# EAGLE design Ver3 (EAGLE 9.6.2)
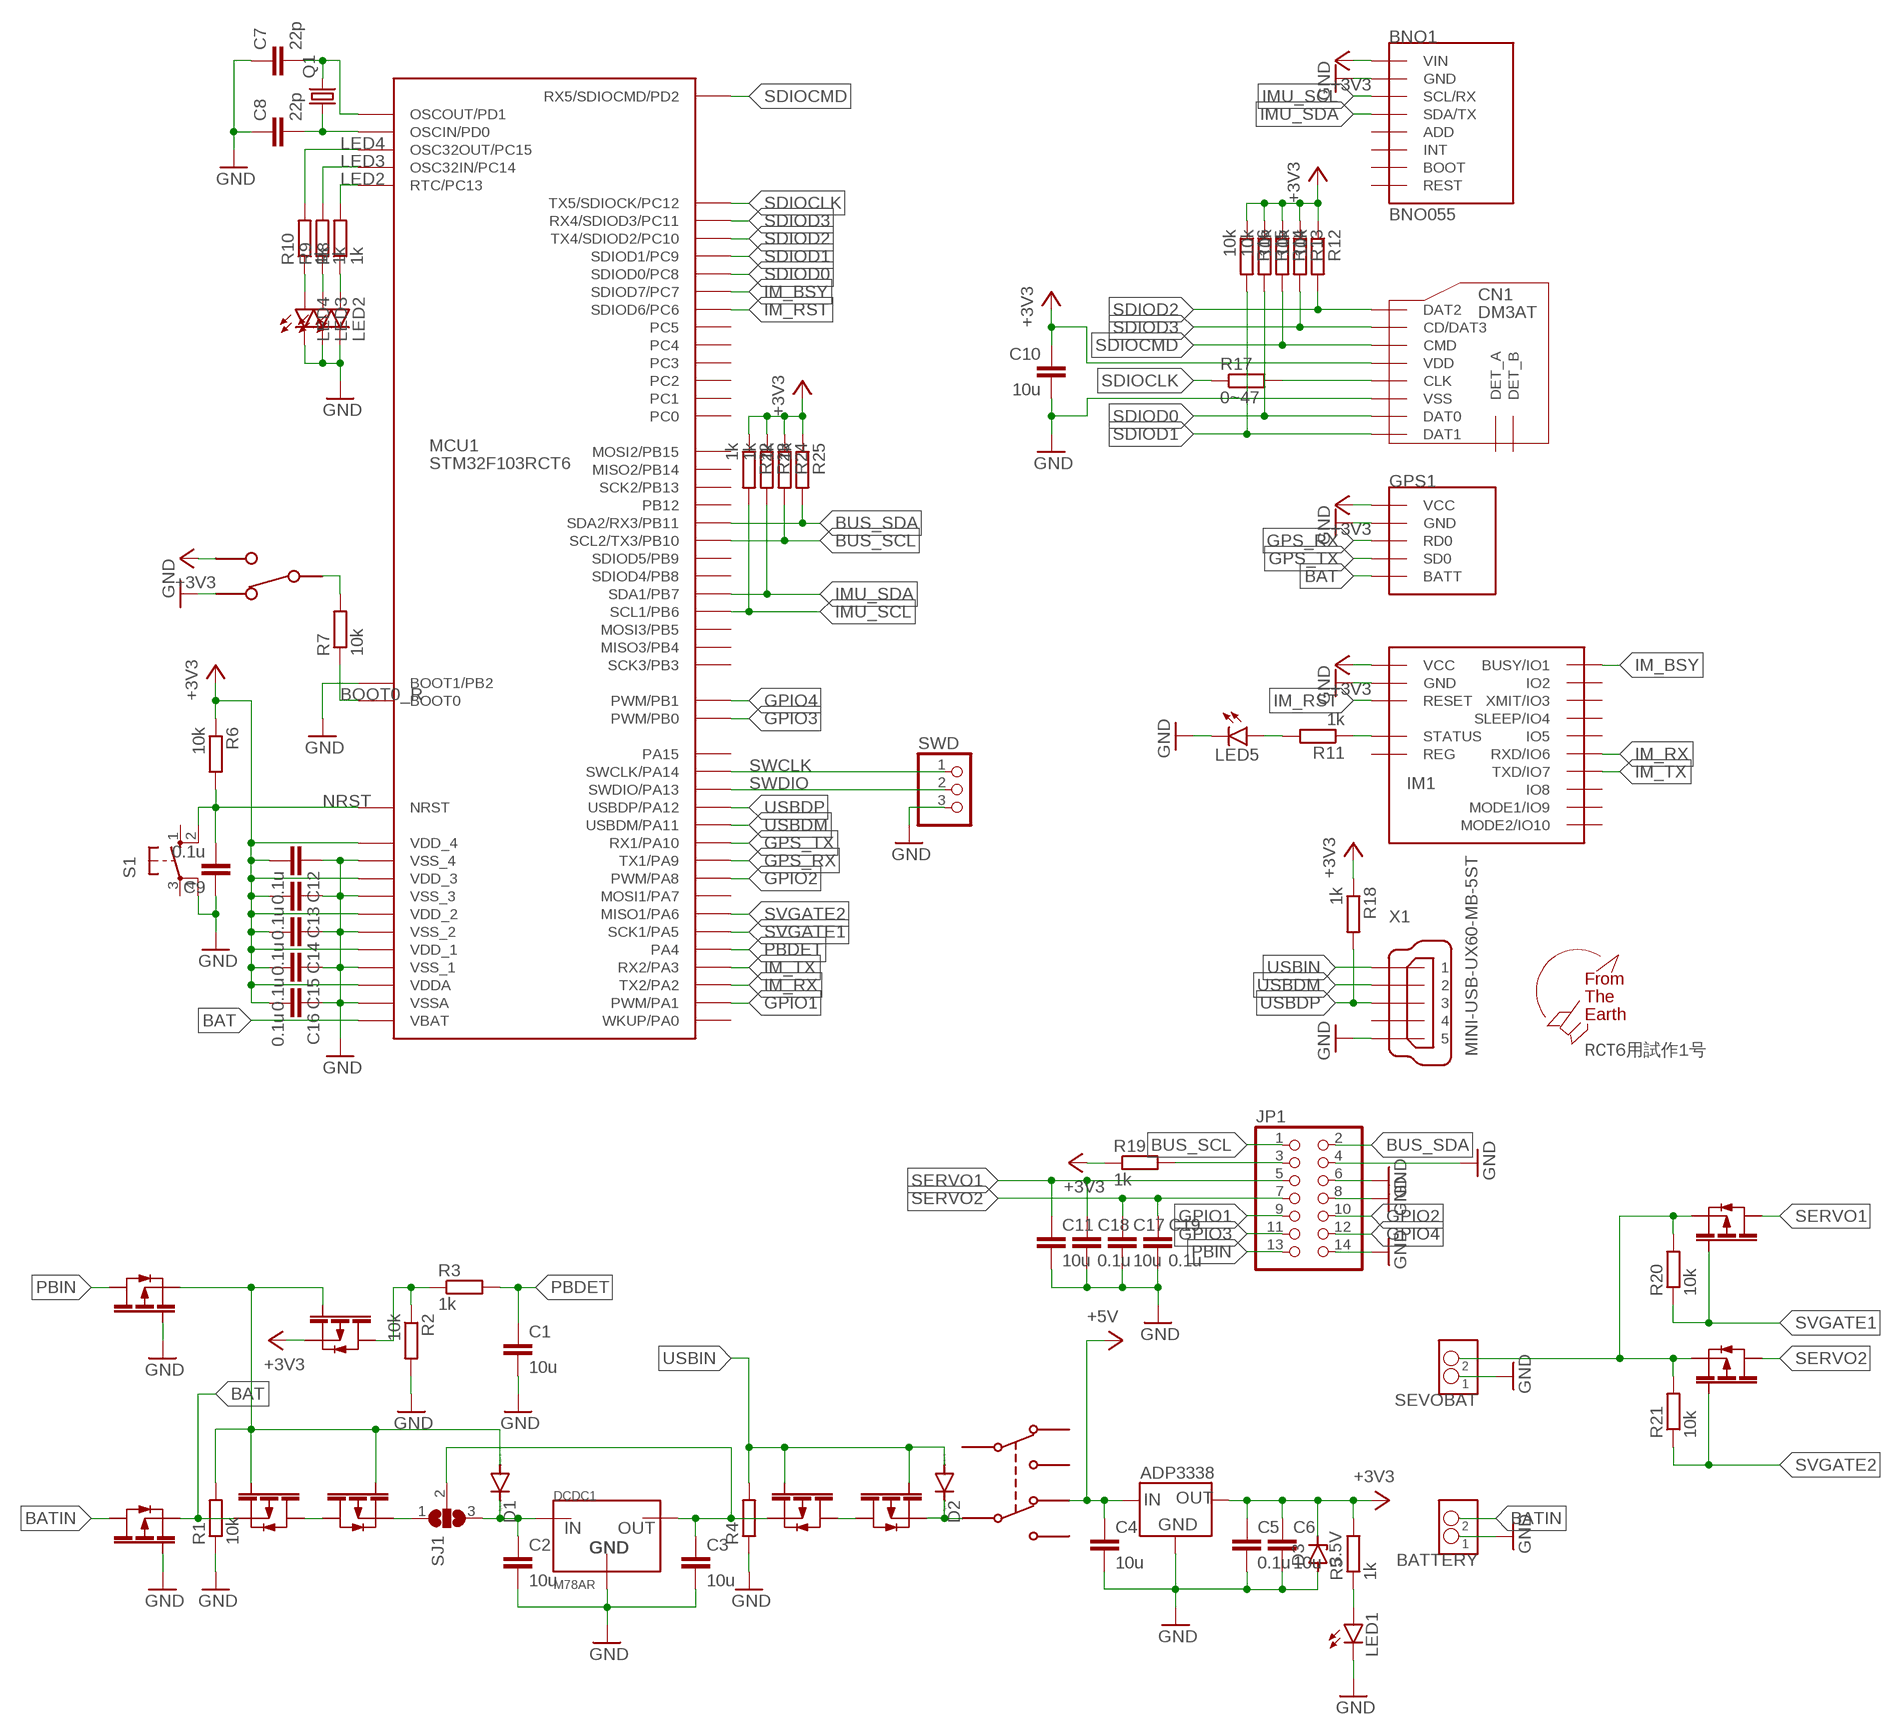
[diagram p0: schematic, sheet 1]

## Parts
BATTERY  S2B-XH-A  [S2B-XH-A]
BNO1  BNO055  [BNO055]
C1  10u  C-EUC0805  [C0805]
C2  10u  C-EUC0805  [C0805]
C3  10u  C-EUC0805  [C0805]
C4  10u  C-EUC0805  [C0805]
C5  0.1u  C-EUC0805  [C0805]
C6  10u  C-EUC0805  [C0805]
C7  22p  C-EUC0805  [C0805]
C8  22p  C-EUC0805  [C0805]
C9  0.1u  C-EUC0805  [C0805]
C10  10u  C-EUC0805  [C0805]
C11  10u  C-EUC0805  [C0805]
C12  0.1u  C-EUC0805  [C0805]
C13  0.1u  C-EUC0805  [C0805]
C14  0.1u  C-EUC0805  [C0805]
C15  0.1u  C-EUC0805  [C0805]
C16  0.1u  C-EUC0805  [C0805]
C17  10u  C-EUC0805  [C0805]
C18  0.1u  C-EUC0805  [C0805]
C19  0.1u  C-EUC0805  [C0805]
CN1  DM3AT  [DM3AT]
D1  DIODE-SOD123  [SOD123]
D2  DIODE-SOD123  [SOD123]
D3  3.5V  ZENER-DIODESMB  [SMB]
DCDC1  M78AR  [M78AR]
FET1  PCH  [SOT-23]
FET2  PCH  [SOT-23]
FET3  PCH  [SOT-23]
FET4  PCH  [SOT-23]
FET5  PCH  [SOT-23]
FET6  PCH  [SOT-23]
FET7  PCH  [SOT-23]
FET8  PCH  [SOT-23]
FET9  PCH  [SOT-23]
GPS1  GPS-54D  [GPS-54D]
IC1  ADP3338-3.3  [SOT-223]
IM1  IM920C  [IM920C]
JP1  PINHD-2X7  [2X07]
LED1  LEDSML0603  [SML0603]
LED2  LEDSML0603  [SML0603]
LED3  LEDSML0603  [SML0603]
LED4  LEDSML0603  [SML0603]
LED5  LEDSML0603  [SML0603]
MCU1  STM32F103RCT6  [LQFP64]
Q1  CRYSTALHC49S  [HC49/S]
R1  10k  R-EU_R0603  [R0603]
R2  10k  R-EU_R0603  [R0603]
R3  1k  R-EU_R0603  [R0603]
R4  R-EU_R0603  [R0603]
R5  1k  R-EU_R0603  [R0603]
R6  10k  R-EU_R0603  [R0603]
R7  10k  R-EU_R0603  [R0603]
R8  1k  R-EU_R0603  [R0603]
R9  1k  R-EU_R0603  [R0603]
R10  1k  R-EU_R0603  [R0603]
R11  1k  R-EU_R0603  [R0603]
R12  10k  R-EU_R0603  [R0603]
R13  10k  R-EU_R0603  [R0603]
R14  10k  R-EU_R0603  [R0603]
R15  10k  R-EU_R0603  [R0603]
R16  10k  R-EU_R0603  [R0603]
R17  0~47  R-EU_R0603  [R0603]
R18  1k  R-EU_R0603  [R0603]
R19  1k  R-EU_R0603  [R0603]
R20  10k  R-EU_R0603  [R0603]
R21  10k  R-EU_R0603  [R0603]
R22  1k  R-EU_R0603  [R0603]
R23  1k  R-EU_R0603  [R0603]
R24  1k  R-EU_R0603  [R0603]
R25  1k  R-EU_R0603  [R0603]
RCT6用試作1号  F.T.E.LOGO  [LOGO]
S1  10-XX  [B3F-10XX]
SEVOBAT  S2B-XH-A  [S2B-XH-A]
SJ1  SJ2W  [SJ_2]
SWD  PINHD-1X3/90  [1X03/90]
U$2  SSSS213202  [SMD_6P]
U$3  MSS22D18  [MSS22D18]
X1  MINI-USB-UX60-MB-5ST  [UX60-MB-5ST]

## Nets
3V3_R [POWER_L]: JP1.3 R19.2
+3V3 [POWER_L]: BNO1.P1(VIN) C5.1 C6.1 C10.1 C12.2 C13.2 C14.2 C15.2 C16.2 CN1.VDD D3.C FET5.P$2 GPS1.VCC IC1.1(OUT) IC1.2(OUT) IM1.$P17(VCC) MCU1.P$13(VDDA) MCU1.P$19(VDD_4) MCU1.P$32(VDD_1) MCU1.P$48(VDD_2) MCU1.P$64(VDD_3) R5.2 R6.1 R12.1 R13.1 R14.1 R15.1 R16.1 R18.1 R19.1 R22.1 R23.1 R24.1 R25.1 U$2.P$0(PD1) U$2.P$5(PD1)
+5V [POWER_L]: C4.1 IC1.3(IN) U$3.P$2
BAT [POWER_L]: FET1.P$2 FET3.P$2 GPS1.BATT MCU1.P$1(VBAT)
BAT_FET2FET [POWER_L]: FET2.P$3 FET3.P$3
BAT_FET2JMP [POWER_L]: FET2.P$2 SJ1.1
BATIN [POWER_L]: BATTERY.P$2 FET1.P$3
BOOT0_PH [SIGNAL]: R7.2 U$2.P$1(PD2) U$2.P$4(PD2)
BOOT0_R [SIGNAL]: MCU1.P$60(BOOT0) R7.1
BUS_SCL [SIGNAL]: JP1.1 MCU1.P$29(SCL2/TX3/PB10) R24.2
BUS_SDA [SIGNAL]: JP1.2 MCU1.P$30(SDA2/RX3/PB11) R25.2
DCDCIN [POWER_L]: C2.1 D1.C DCDC1.P3(IN) SJ1.3
GND [GND]: BATTERY.P$1 BNO1.P2(GND) C1.2 C2.2 C3.2 C4.2 C5.2 C6.2 C7.1 C8.1 C9.1 C10.2 C11.2 C12.1 C13.1 C14.1 C15.1 C16.1 C17.2 C18.2 C19.2 CN1.VSS D3.A DCDC1.P2(GND) FET1.P$1 FET4.P$1 GPS1.GND IC1.4(GND) IM1.$P18(GND) JP1.4 JP1.6 JP1.8 JP1.14 LED1.C LED2.C LED3.C LED4.C LED5.C MCU1.P$12(VSSA) MCU1.P$18(VSS_4) MCU1.P$28(BOOT1/PB2) MCU1.P$31(VSS_1) MCU1.P$47(VSS_2) MCU1.P$63(VSS_3) R1.1 R2.2 R4.1 S1.4(P1) SEVOBAT.P$1 SWD.3 U$2.P$2(PD3) U$2.P$3(PD3) X1.5
GPIO1 [SIGNAL]: JP1.9 MCU1.P$15(PWM/PA1)
GPIO2 [SIGNAL]: JP1.10 MCU1.P$41(PWM/PA8)
GPIO3 [SIGNAL]: JP1.11 MCU1.P$26(PWM/PB0)
GPIO4 [SIGNAL]: JP1.12 MCU1.P$27(PWM/PB1)
GPS_RX [SIGNAL]: GPS1.RD0 MCU1.P$42(TX1/PA9)
GPS_TX [SIGNAL]: GPS1.SD0 MCU1.P$43(RX1/PA10)
IM_BSY [SIGNAL]: IM1.$P1(BUSY/IO1) MCU1.P$38(SDIOD7/PC7)
IM_LED [SIGNAL]: LED5.A R11.2
IM_R [SIGNAL]: IM1.$P15(STATUS) R11.1
IM_RST [SIGNAL]: IM1.$P19(RESET) MCU1.P$37(SDIOD6/PC6)
IM_RX [SIGNAL]: IM1.$P6(RXD/IO6) MCU1.P$16(TX2/PA2)
IM_TX [SIGNAL]: IM1.$P7(TXD/IO7) MCU1.P$17(RX2/PA3)
IMU_SCL [SIGNAL]: BNO1.P3(SCL/RX) MCU1.P$58(SCL1/PB6) R22.2
IMU_SDA [SIGNAL]: BNO1.P4(SDA/TX) MCU1.P$59(SDA1/PB7) R23.2
LED2 [SIGNAL]: MCU1.P$2(RTC/PC13) R8.2
LED2R [SIGNAL]: LED2.A R8.1
LED3 [SIGNAL]: MCU1.P$3(OSC32IN/PC14) R9.2
LED3R [SIGNAL]: LED3.A R9.1
LED4 [SIGNAL]: MCU1.P$4(OSC32OUT/PC15) R10.2
LED4R [SIGNAL]: LED4.A R10.1
NRST [SIGNAL]: C9.2 MCU1.P$7(NRST) R6.2 S1.2(S1)
OSCIN [SIGNAL]: C8.2 MCU1.P$5(OSCIN/PD0) Q1.1
OSCOUT [SIGNAL]: C7.2 MCU1.P$6(OSCOUT/PD1) Q1.2
PB_ARV2GATES [POWER_L]: D1.A FET2.P$1 FET3.P$1 FET4.P$2 FET5.P$1 R1.2
PB_FET2R [SIGNAL]: FET5.P$3 R2.1 R3.1
PBDET [SIGNAL]: C1.1 MCU1.P$20(PA4) R3.2
PBIN [POWER_L]: FET4.P$3 JP1.13
PWR_SWC [POWER_L]: D2.C FET7.P$2 U$3.P$1
REG_DCDC2FET [POWER_L]: C3.1 DCDC1.P1(OUT) FET6.P$2 SJ1.2
REG_FET2FET [POWER_L]: FET6.P$3 FET7.P$3
REG_R2LED [SIGNAL]: LED1.A R5.1
SDIOCLK [SIGNAL]: MCU1.P$53(TX5/SDIOCK/PC12) R17.1
SDIOCLK_R [SIGNAL]: CN1.CLK R17.2
SDIOCMD [SIGNAL]: CN1.CMD MCU1.P$54(RX5/SDIOCMD/PD2) R14.2
SDIOD0 [SIGNAL]: CN1.DAT0 MCU1.P$39(SDIOD0/PC8) R15.2
SDIOD1 [SIGNAL]: CN1.DAT1 MCU1.P$40(SDIOD1/PC9) R16.2
SDIOD2 [SIGNAL]: CN1.DAT2 MCU1.P$51(TX4/SDIOD2/PC10) R12.2
SDIOD3 [SIGNAL]: CN1.CD/DAT3 MCU1.P$52(RX4/SDIOD3/PC11) R13.2
SERVO1 [POWER_H]: C11.1 C18.1 FET8.P$3 JP1.5
SERVO2 [POWER_H]: C17.1 C19.1 FET9.P$3 JP1.7
SVGATE1 [SIGNAL]: FET8.P$1 MCU1.P$21(SCK1/PA5) R20.1
SVGATE2 [SIGNAL]: FET9.P$1 MCU1.P$22(MISO1/PA6) R21.1
SVIN [POWER_H]: FET8.P$2 FET9.P$2 R20.2 R21.2 SEVOBAT.P$2
SWCLK [SIGNAL]: MCU1.P$49(SWCLK/PA14) SWD.1
SWDIO [SIGNAL]: MCU1.P$46(SWDIO/PA13) SWD.2
USBDM [SIGNAL]: MCU1.P$44(USBDM/PA11) X1.2
USBDP [SIGNAL]: MCU1.P$45(USBDP/PA12) R18.2 X1.3
USBIN [POWER_L]: D2.A FET6.P$1 FET7.P$1 R4.2 X1.1
Unconnected: BNO1.P5(ADD) BNO1.P6(INT) BNO1.P7(BOOT) BNO1.P8(REST) CN1.DET_A CN1.DET_B IM1.$P2(IO2) IM1.$P3(XMIT/IO3) IM1.$P4(SLEEP/IO4) IM1.$P5(IO5) IM1.$P8(IO8) IM1.$P9(MODE1/IO9) IM1.$P10(MODE2/IO10) IM1.$P16(REG) MCU1.P$8(PC0) MCU1.P$9(PC1) MCU1.P$10(PC2) MCU1.P$11(PC3) MCU1.P$14(WKUP/PA0) MCU1.P$23(MOSI1/PA7) MCU1.P$24(PC4) MCU1.P$25(PC5) MCU1.P$33(PB12) MCU1.P$34(SCK2/PB13) MCU1.P$35(MISO2/PB14) MCU1.P$36(MOSI2/PB15) MCU1.P$50(PA15) MCU1.P$55(SCK3/PB3) MCU1.P$56(MISO3/PB4) MCU1.P$57(MOSI3/PB5) MCU1.P$61(SDIOD4/PB8) MCU1.P$62(SDIOD5/PB9) S1.1(S) S1.3(P) U$3.P$0 U$3.P$3 U$3.P$4 U$3.P$5 X1.4

## Library data of the parts
BATTERY SEVOBAT = JST-Con:S2B-XH-A
BNO1 = BNO055:BNO055
C1-C19 = rcl:C-EU: CAPACITOR, European symbol; SPICEPREFIX: C
CN1 = microSD:DM3AT
D1 D2 = diode:DIODE-: DIODE
D3 = diode:ZENER-DIODE: Z-Diode
DCDC1 = M78AR:M78AR
FET1-FET9 = MOSFET:PCH
GPS1 = GPS-54D:GPS-54D
IC1 = ADP3338:ADP3338-3.3
IM1 = IM920:IM920C
JP1 = pinhead:PINHD-2X7: PIN HEADER
LED1-LED5 = led:LED: LED OSRAM: - CHIPLED LG R971, LG N971, LY N971, LG Q971, LY Q971, LO R971, LY R971 LH N974, LH R974 LS Q976, LO Q976, LY Q976 LO Q996 - Hyper CHIPLED LW Q18S LB Q993, LB Q99A, LB R99A - SideLED LS A670, LO A670, LY A670, LG A670, LP A670 LB A673, LV A673, LT A673, LW A673 LH A674 LY A675 LS A676, LA A676, LO A676, LY A676, LW A676 LS A679, LY A679, LG A679 - Hyper Micro SIDELED® LS Y876, LA Y876, LO Y876, LY Y876 LT Y87S - SmartLED LW L88C, LW L88S LB L89C, LB L89S, LG L890 LS L89K, LO L89K, LY L89K LS L896, LA L896, LO L896, LY L896 - TOPLED LS T670, LO T670, LY T670, LG T670, LP T670 LSG T670, LSP T670, LSY T670, LOP T670, LYG T670 LG T671, LOG T671, LSG T671 LB T673, LV T673, LT T673, LW T673 LH T674 LS T676, LA T676, LO T676, LY T676, LB T676, LH T676, LSB T676, LW T676 LB T67C, LV T67C, LT T67C, LS T67K, LO T67K, LY T67K, LW E67C LS E67B, LA E67B, LO E67B, LY E67B, LB E67C, LV E67C, LT E67C LW T67C LS T679, LY T679, LG T679 LS T770, LO T770, LY T770, LG T770, LP T770 LB T773, LV T773, LT T773, LW T773 LH T774 LS E675, LA E675, LY E675, LS T675 LS T776, LA T776, LO T776, LY T776, LB T776 LHGB T686 LT T68C, LB T68C - Hyper Mini TOPLED® LB M676 - Mini TOPLED Santana® LG M470 LS M47K, LO M47K, LY M47K Source: http://www.osram.convergy.de LUXEON: - LUMILED® LXK2-PW12-R00, LXK2-PW12-S00, LXK2-PW14-U00, LXK2-PW14-V00 LXK2-PM12-R00, LXK2-PM12-S00, LXK2-PM14-U00 LXK2-PE12-Q00, LXK2-PE12-R00, LXK2-PE12-S00, LXK2-PE14-T00, LXK2-PE14-U00 LXK2-PB12-K00, LXK2-PB12-L00, LXK2-PB12-M00, LXK2-PB14-N00, LXK2-PB14-P00, LXK2-PB14-Q00 LXK2-PR12-L00, LXK2-PR12-M00, LXK2-PR14-Q00, LXK2-PR14-R00 LXK2-PD12-Q00, LXK2-PD12-R00, LXK2-PD12-S00 LXK2-PH12-R00, LXK2-PH12-S00 LXK2-PL12-P00, LXK2-PL12-Q00, LXK2-PL12-R00 Source: www.luxeon.com KINGBRIGHT: KA-3528ASYC Source: www.kingbright.com
MCU1 = STM32F103:STM32F103RCT6
Q1 = crystal:CRYSTAL: CRYSTAL; OC_FARNELL: 1667008; OC_NEWARK: unknown
R1-R25 = rcl:R-EU_: RESISTOR, European symbol; SPICEPREFIX: R
RCT6用試作1号 = logo:F.T.E.LOGO
S1 = switch-omron:10-XX: OMRON SWITCH; MPN: B3F-1000; OC_FARNELL: 176432; OC_NEWARK: 36M3542
SJ1 = jumper:SJ2W: SMD solder JUMPER
SWD = pinhead:PINHD-1X3: PIN HEADER
U$2 = switch_slide:SSSS213202
U$3 = switch_slide:MSS22D18
X1 = con-hirose:MINI-USB-: MINI USB Connector Source: http://www.hirose.co.jp/cataloge_hp/e24000019.pdf; OC_FARNELL: unknown; OC_NEWARK: unknown

## Net classes
1 SIGNAL: width 0.152 mm, drill 0.305 mm, clearance 0.152 mm
2 POWER_H: width 0.457 mm, drill 0.305 mm, clearance 0.152 mm
3 POWER_L: width 0.305 mm, drill 0.305 mm, clearance 0.152 mm
4 GND: width 0.305 mm, drill 0.305 mm, clearance 0.152 mm

## Board
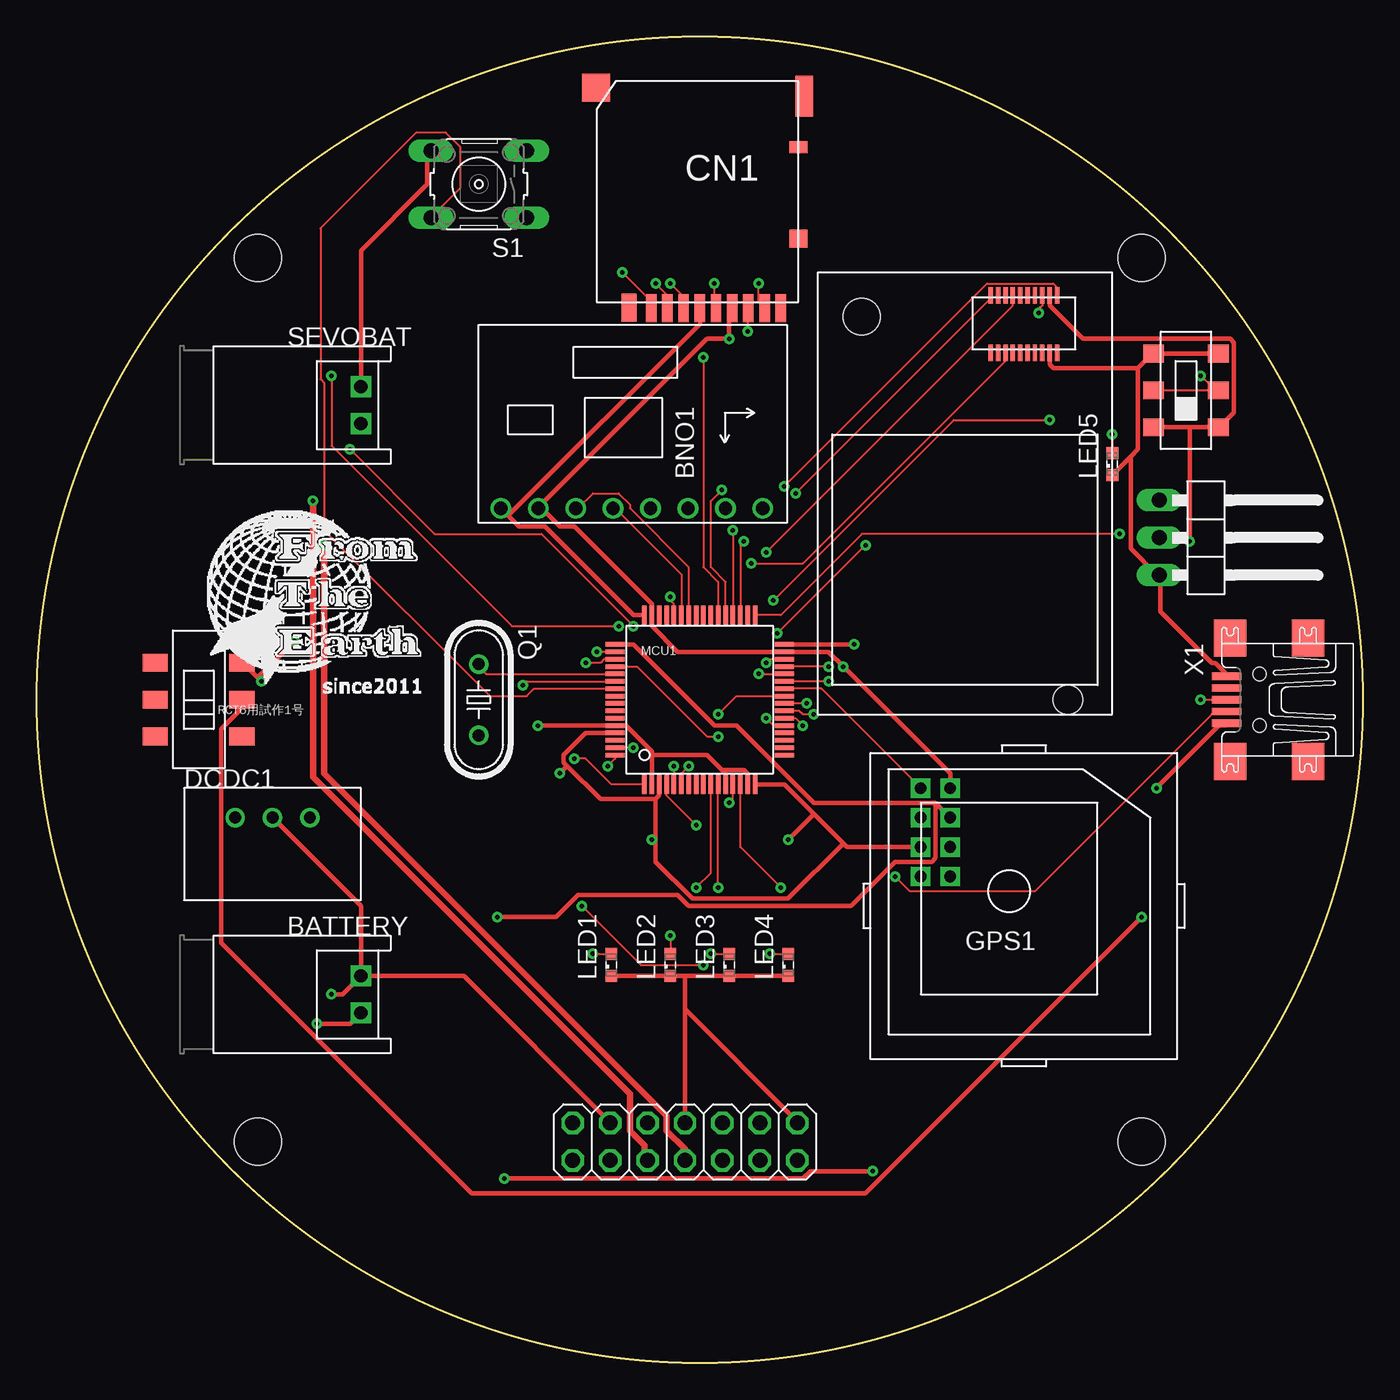
[diagram p1: board, top side]
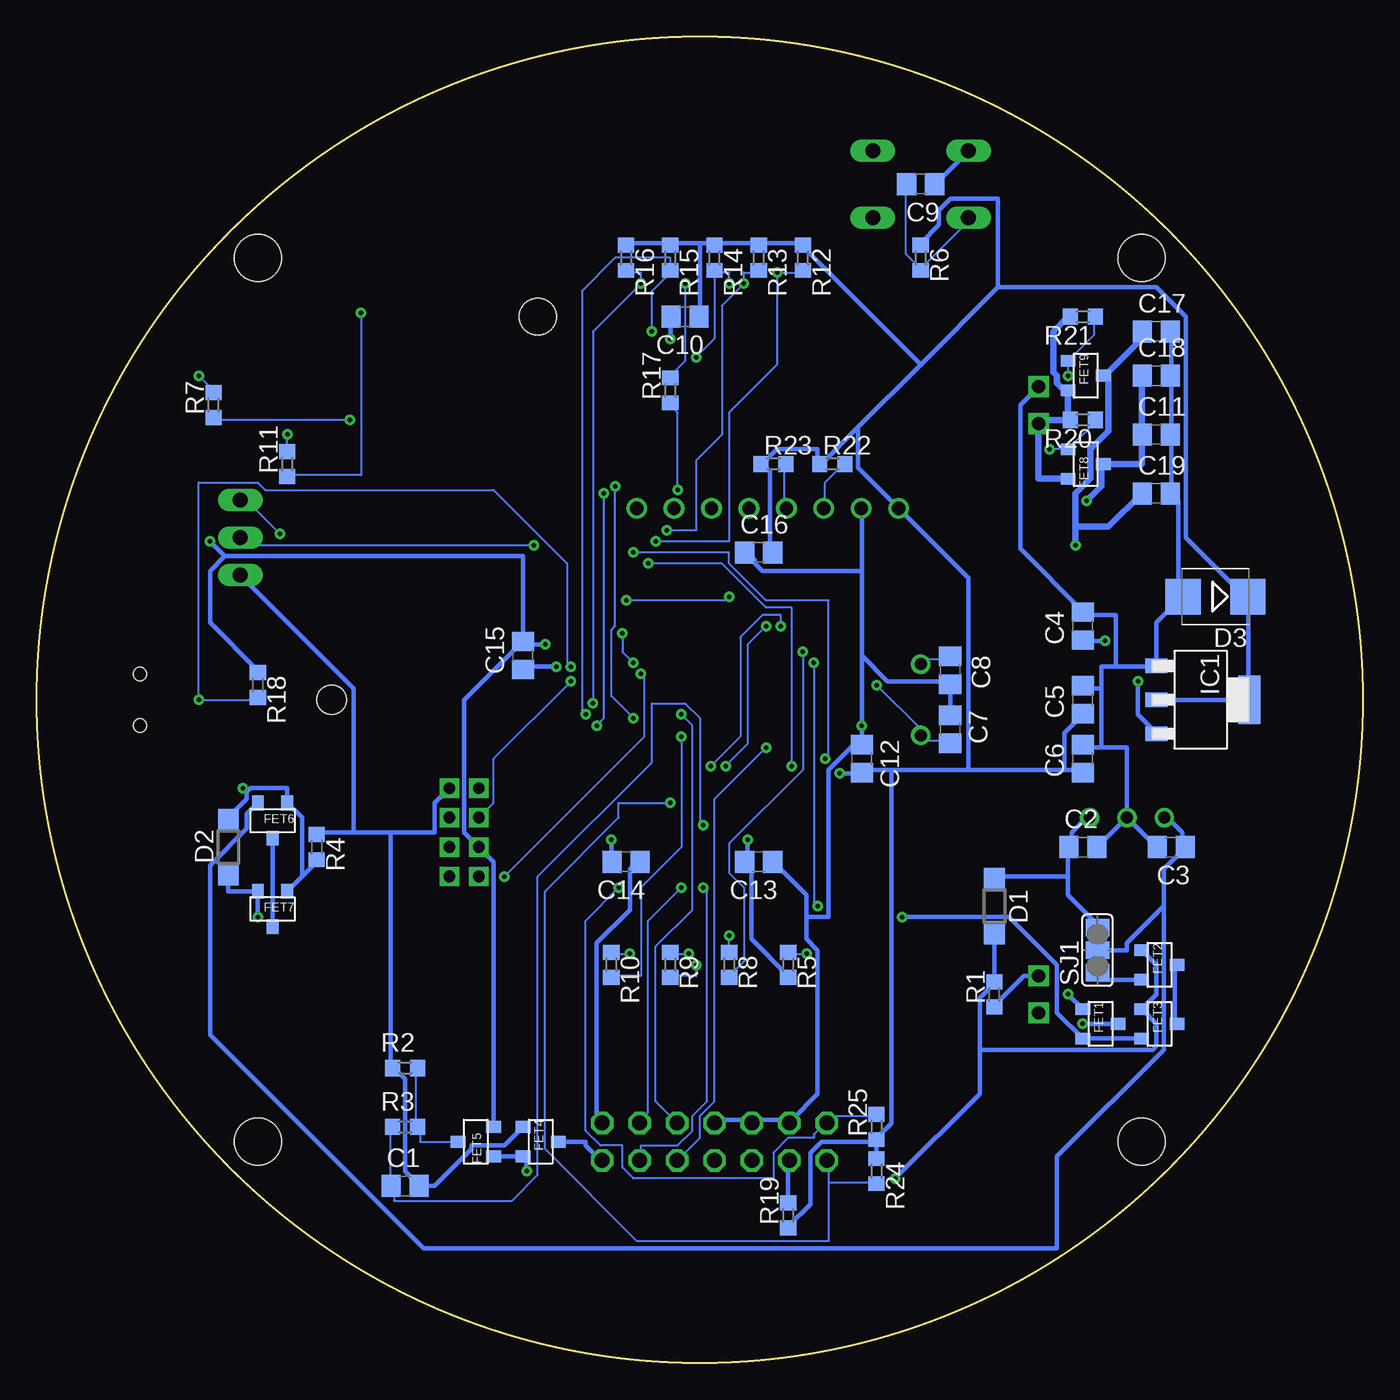
[diagram p2: board, bottom side, seen from below]

Size 90 x 90 mm. Coordinates in mm from the lower left corner, seen from the top.
Outline: circle at 45,45 radius 45
Copper layers (1*16): Top 0.035mm / dielectric 1.5mm / Bottom 0.035mm
Design rules "PCBGoGo": minimum track width 6mil, minimum drill 0.2mm, track to track 6mil, track to pad 6mil, pad to pad 6mil, via to via 6mil, smd to smd 6mil, copper to edge 0.2mm, drill to drill 6mil, minimum pad ring 10mil, minimum via ring 8mil, stop-mask expansion 4mil, vias tented up to drill 0mil, thermal gap 10mil
Holes 3.2 mm at 75,75 15,75 15,15 75,15

### Footprints (pad centres in the part's own frame; a part is rotated, then mirrored left to right if it is on the bottom)
S2B-XH-A = drill 0.9 square: P$1 0,1.25; P$2 0,-1.25
BNO055 = drill 0.9: P1 -7,11.5; P2 -7,8.96; P3 -7,6.42; P4 -7,3.88; P5 -7,1.34; P6 -7,-1.2; P7 -7,-3.74; P8 -7,-6.28
C0805 = smd 1.3 x 1.5: 1 -0.95,0; 2 0.95,0
DM3AT = smd 0.7 x 1.9: CD/DAT3 2.2,6.4; CLK -1.1,6.4; CMD 1.1,6.4; DAT0 -3.3,6.4; DAT1 -4.4,6.4; DAT2 3.3,6.4; DET_B -5.5,6.4; VDD 0,6.4; VSS -2.2,6.4 | smd 1.2 x 0.8: DET_A -6.7,-4.5 | smd 1 x 1.9: P$9 4.8,6.381 | smd 1.2 x 1.2: P$11 -6.7,1.7 | smd 1.2 x 2.8: P$13 -7.081,-7.973 | smd 1.9 x 1.9: P$14 7.054,-8.562
SOD123 = smd 1.4 x 1.4: A 1.9,0; C -1.9,0
SMB = smd 2.4 x 2.4: A 2.2,0; C -2.2,0
M78AR = drill 0.8: P1 -2.54,0; P2 0,0; P3 2.54,0
SOT-23 = smd 0.8 x 1: P$1 -1,0; P$2 1,0; P$3 0,2.4
GPS-54D = drill 0.8 square: BATT -5,6; GND -5,8; NC1 -5,4; NC2 -7,2; NC3 -5,2; RD0 -7,8; SD0 -7,6; VCC -7,4
SOT-223 = smd 3.3 x 1.5: 1 0,3.3 | smd 1 x 1.5: 2 0,-3; 3 2.3,-3; 4 -2.3,-3
IM920C = smd 0.3 x 1.1: $P1 -1.75,-13.45; $P2 -1.75,-9.55; $P3 -2.25,-13.45; $P4 -2.25,-9.55; $P5 -2.75,-13.45; $P6 -2.75,-9.55; $P7 -3.25,-13.45; $P8 -3.25,-9.55; $P9 -3.75,-13.45; $P10 -3.75,-9.55; $P11 -4.25,-13.45; $P12 -4.25,-9.55; $P13 -4.75,-13.45; $P14 -4.75,-9.55; $P15 -5.25,-13.45; $P16 -5.25,-9.55; $P17 -5.75,-13.45; $P18 -5.75,-9.55; $P19 -6.25,-13.45; $P20 -6.25,-9.55 | hole 2.5: 7,-12 | hole 2: -7,14
2X07 = drill 1.016 octagon: 1 -7.62,-1.27; 2 -7.62,1.27; 3 -5.08,-1.27; 4 -5.08,1.27; 5 -2.54,-1.27; 6 -2.54,1.27; 7 0,-1.27; 8 0,1.27; 9 2.54,-1.27; 10 2.54,1.27; 11 5.08,-1.27; 12 5.08,1.27; 13 7.62,-1.27; 14 7.62,1.27
SML0603 = smd 0.8 x 0.8: A 0.75,0; C -0.75,0
LQFP64 = smd 1.27 x 0.305: P$1 -5.75,3.75; P$2 -5.75,3.25; P$3 -5.75,2.75; P$4 -5.75,2.25; P$5 -5.75,1.75; P$6 -5.75,1.25; P$7 -5.75,0.75; P$8 -5.75,0.25; P$9 -5.75,-0.25; P$10 -5.75,-0.75; P$11 -5.75,-1.25; P$12 -5.75,-1.75; P$13 -5.75,-2.25; P$14 -5.75,-2.75; P$15 -5.75,-3.25; P$16 -5.75,-3.75; P$33 5.75,-3.75; P$34 5.75,-3.25; P$35 5.75,-2.75; P$36 5.75,-2.25; P$37 5.75,-1.75; P$38 5.75,-1.25; P$39 5.75,-0.75; P$40 5.75,-0.25; P$41 5.75,0.25; P$42 5.75,0.75; P$43 5.75,1.25; P$44 5.75,1.75; P$45 5.75,2.25; P$46 5.75,2.75; P$47 5.75,3.25; P$48 5.75,3.75 | smd 0.305 x 1.27: P$17 -3.75,-5.75; P$18 -3.25,-5.75; P$19 -2.75,-5.75; P$20 -2.25,-5.75; P$21 -1.75,-5.75; P$22 -1.25,-5.75; P$23 -0.75,-5.75; P$24 -0.25,-5.75; P$25 0.25,-5.75; P$26 0.75,-5.75; P$27 1.25,-5.75; P$28 1.75,-5.75; P$29 2.25,-5.75; P$30 2.75,-5.75; P$31 3.25,-5.75; P$32 3.75,-5.75; P$49 3.75,5.75; P$50 3.25,5.75; P$51 2.75,5.75; P$52 2.25,5.75; P$53 1.75,5.75; P$54 1.25,5.75; P$55 0.75,5.75; P$56 0.25,5.75; P$57 -0.25,5.75; P$58 -0.75,5.75; P$59 -1.25,5.75; P$60 -1.75,5.75; P$61 -2.25,5.75; P$62 -2.75,5.75; P$63 -3.25,5.75; P$64 -3.75,5.75
HC49/S = drill 0.813: 1 -2.413,0; 2 2.413,0
R0603 = smd 1 x 1.1: 1 -0.85,0; 2 0.85,0
B3F-10XX = drill 1.016 long: 1 -3.251,2.261; 2 3.251,2.261; 3 -3.251,-2.261; 4 3.251,-2.261
SJ_2 = smd 1.168 x 1.6: 1 -1.524,0; 2 0,0; 3 1.524,0
1X03/90 = drill 1.016 long: 1 -2.54,-3.81; 2 0,-3.81; 3 2.54,-3.81
SMD_6P = smd 1.2 x 1.4: P$0 -2.5,-2.2; P$1 0,-2.2; P$2 2.5,-2.2; P$3 2.5,2.2; P$4 0,2.2; P$5 -2.5,2.2
MSS22D18 = smd 1.2 x 1.7: P$0 -2.492,-2.923; P$1 0.008,-2.923; P$2 2.508,-2.923; P$3 2.508,2.977; P$4 0.008,2.977; P$5 -2.492,2.977
UX60-MB-5ST = smd 2 x 0.5: 1 2.25,1.6; 2 2.25,0.8; 3 2.25,0; 4 2.25,-0.8; 5 2.25,-1.6 | smd 2.2 x 2.5: M1 -3.3,-4.2; M2 -3.3,4.2; M3 2,4.2; M4 2,-4.2 | hole 0.9: 0,-1.75; 0,1.75

### Placement (x,y rotation side)
BATTERY  22,25 0 top
BNO1  43,65 90 top
C1  65,12 0 bottom
C2  19,35 0 bottom
C3  13,35 180 bottom
C4  19,50 90 bottom
C5  19,45 90 bottom
C6  19,41 90 bottom
C7  28,43 270 bottom
C8  28,47 90 bottom
C9  30,80 180 bottom
C10  46,71 180 bottom
C11  14,63 0 bottom
C12  34,41 270 bottom
C13  41,34 180 bottom
C14  50,34 180 bottom
C15  57,48 90 bottom
C16  41,55 0 bottom
C17  14,70 0 bottom
C18  14,67 0 bottom
C19  14,59 0 bottom
CN1  45,78 180 top
D1  25,31 270 bottom
D2  77,35 90 bottom
D3  10,52 180 bottom
DCDC1  16,37 0 top
FET1  19,23 270 bottom
FET2  15,27 270 bottom
FET3  15,23 270 bottom
FET4  57,15 270 bottom
FET5  59,15 90 bottom
FET6  74,38 180 bottom
FET7  74,32 180 bottom
FET8  20,61 270 bottom
FET9  20,67 270 bottom
GPS1  67,31 0 top
IC1  11,45 270 bottom
IM1  63,59 180 top
JP1  44,15 0 top
LED1  39,27 90 top
LED2  43,27 90 top
LED3  47,27 90 top
LED4  51,27 90 top
LED5  73,61 90 top
MCU1  45,45 0 top
Q1  30,45 270 top
R1  25,25 90 bottom
R2  65,20 180 bottom
R3  65,16 180 bottom
R4  71,35 270 bottom
R5  39,27 270 bottom
R6  30,75 270 bottom
R7  78,65 90 bottom
R8  43,27 270 bottom
R9  47,27 270 bottom
R10  51,27 270 bottom
R11  73,61 90 bottom
R12  38,75 270 bottom
R13  41,75 270 bottom
R14  44,75 270 bottom
R15  47,75 270 bottom
R16  50,75 270 bottom
R17  47,66 90 bottom
R18  75,46 270 bottom
R19  39,10 90 bottom
R20  19,64 180 bottom
R21  19,71 180 bottom
R22  36,61 0 bottom
R23  40,61 0 bottom
R24  33,13 270 bottom
R25  33,16 90 bottom
RCT6用試作1号  11,44 0 top
S1  30,80 180 top
SEVOBAT  22,65 0 top
SJ1  18,28 90 bottom
SWD  80,56 270 top
U$2  78,66 90 top
U$3  11,45 90 top
X1  83,45 180 top

### Tracks (layer width: path | path; a pad name or v marks a point on that pad's centre or on a via)
3V3_R
  Bottom 0.305: R19.2 39,13.5 JP1.3
+3V3  (via drill 0.3)
  Top 0.305: MCU1.P$13 37.25,42.75 35.75,41.25 35.75,40.75 36,40.5 | 36,40.5 38.25,38.25 42,38.25 | 42,38.25 42.25,38.5 MCU1.P$19 | MCU1.P$32 50.75,39.25 52.75,37.25 | 54.75,35.25 55,35 GPS1.VCC | 54.75,35.25 52.75,37.25 | 52.75,37.25 v51,35.5 | 42,35.5 42,34 44.5,31.5 51,31.5 54.75,35.25 | 42,35.5 42,38.25 | 42,35.5 v41.75,35.5 | IM1.$P17 68.75,71.75 71,69.5 81,69.5 81.25,69.25 81.25,64.5 80.25,63.5 U$2.P$0 78.25,63.5 | 78.25,63.5 U$2.P$5 | v55.5,48.75 MCU1.P$48 | v78.25,55.75 78.25,63.5 | MCU1.P$64 40.5,50.75 34.5,56.75 32.75,56.75 32,57.5 | BNO1.P1 32,57.5 | CN1.VDD 45,70.5 32,57.5 | v35.5,40 36,40.5
  Bottom 0.305: 41.75,34 41.5,33.75 41.5,28.75 39,26.25 R5.2 | FET5.P$2 59,34 GPS1.VCC 61,36 61,45 57,49 | v51,35.5 51,34 C14.2 | v41.75,35.5 41.75,34 | 41.75,34 C13.2 | 77.25,54.75 78.25,53.75 78.25,50.25 75,47 R18.1 | 77.25,54.75 57,54.75 57,49 | v55.5,48.75 57,48.75 C15.2 57,49 | 77.25,54.75 v78.25,55.75 | 33,15 R24.1 | 33,15 36.75,15 37.5,14.25 37.5,10.75 39,9.25 R19.1 | 33,15 R25.1 33,15.25 32,16.25 32,40.25 | 20.25,40.25 19,40.25 C6.1 | 20.25,40.25 20.25,42.75 19,44 C5.1 | 20.25,40.25 26.75,40.25 | 26.75,40.25 32,40.25 | 32,40.25 34,40.25 C12.2 34,40 v35.5,40 | 7.75,45 IC1.2 | 7.75,45 7.75,52 D3.C 8,52 12,56 12,71 14,73 24.75,73 | 7.75,45 IC1.1 | 41,76 38,76 R12.1 38,75.75 30,67.75 | 41,76 44,76 | 41,76 R13.1 | 44,76 45,76 | 45,76 47,76 | 44,76 R14.1 | 47,76 50,76 R16.1 | 47,76 R15.1 | 45,76 45,71 C10.1 | 40.75,61 40.25,60.5 40.25,55 C16.2 | 24.75,73 24.75,79 28,79 28.75,78.25 28.75,77.25 30,76 R6.1 | 34.25,63.5 36.75,61 R22.1 37,61 37,62 39.75,62 40.75,61 | 34.25,63.5 30,67.75 | 30,67.75 24.75,73 | 40.75,61 R23.1 | 34.25,63.5 34.25,60.75 BNO1.P1 26.75,53.25 26.75,40.25
+5V  (via drill 0.3)
  Top 0.305: 15,46.5 14,47.5 U$3.P$2 | 15,46.5 v17.5,49 | 15,46.5 v15.25,46.25
  Bottom 0.305: v15.25,46.25 15.25,44 14,42.75 IC1.3 | v17.5,49 19,49 C4.1
BAT  (via drill 0.3)
  Top 0.305: MCU1.P$1 40.5,48.75 46,43.25 47.5,43.25 52.75,38 61,38 | GPS1.BATT 61,38 | v31.25,30.25 35.25,30.25 36.75,31.75 43.5,31.75 44.25,31 55.25,31 58.25,34 60.75,34 61,34.25 61,38
  Bottom 0.305: FET3.P$2 FET1.P$2 20.75,23.75 20.75,27 24,30.25 v31.25,30.25
BAT_FET2FET
  Bottom 0.305: FET3.P$3 12.75,23 12.75,27 FET2.P$3
BAT_FET2JMP
  Bottom 0.305: FET2.P$2 18,26 SJ1.1
BATIN  (via drill 0.3)
  Top 0.305: v19,23 21.25,23 BATTERY.P$2
  Bottom 0.305: v19,23 FET1.P$3
BOOT0_PH  (via drill 0.3)
  Top 0.152: 80,66 v79,67 | 80,66 U$2.P$4 | 80,66 U$2.P$1
  Bottom 0.152: v79,67 78,66 R7.2
BOOT0_R  (via drill 0.3)
  Top 0.152: v68.75,64 62.25,64 v50,51.75 | v43,52 43,51.75 43.25,51.5 MCU1.P$60
  Bottom 0.152: v68.75,64 78,64 R7.1 | v50,51.75 43,51.75 v43,52
BUS_SCL  (via drill 0.3)
  Top 0.152: MCU1.P$29 47.25,38.25 v47,38
  Bottom 0.152: 36.25,12.25 33,12.25 R24.2 | 36.25,12.25 36.25,13.5 JP1.1 | v47,38 50.5,38 50.5,37 55.5,32 55.5,14.5 49.25,8.25 36.25,8.25 36.25,12.25
BUS_SDA  (via drill 0.3)
  Top 0.152: MCU1.P$30 47.75,35 v50.5,32.25
  Bottom 0.152: R25.2 33,16.75 36.25,16.75 36.25,16.5 JP1.2 36.5,16.25 37.25,15.5 37.25,15.25 39,15.25 40,14.25 40,12.5 49.5,12.5 50.25,13.25 50.25,14.75 51.75,14.75 52.75,15.75 52.75,30 v50.5,32.25
DCDCIN
  Bottom 0.305: 20,33 25,33 D1.C | 20,33 20,35 C2.1 19.75,35 19.75,36 18.75,37 DCDC1.P3 | 20,33 20,31.75 18,29.75 SJ1.3
GND  (via drill 0.3)
  Top 0.305: X1.5 80.75,46.75 80,47.5 79.75,47.5 76.25,51 76.25,53.25 SWD.3 76,53.5 74.25,55.25 74.25,61.5 | 74.25,61.5 74.75,62 74.75,67.5 | 74.25,61.5 LED5.C | 74.75,67.5 75.75,68.5 U$2.P$3 U$2.P$2 | IM1.$P18 68.75,67.75 69,67.5 74.75,67.5 | GPS1.GND 62,40 v54.75,47.25 53.75,48.25 MCU1.P$47 43.5,48.25 41.75,50 MCU1.P$63 41.75,51.5 36.5,56.75 35.5,56.75 34.25,58 BNO1.P2 34,58 45.5,69.5 v47,69.5 47,71.5 CN1.VSS | v20,25 20.75,25 BATTERY.P$1 | SEVOBAT.P$1 22,75.5 26.5,80 26.5,82.25 S1.4 | BATTERY.P$1 22,31 DCDC1.P2 | LED1.C LED2.C 44,26.25 | 44,26.25 LED3.C LED4.C | JP1.8 44,24 | 44,24 44,26.25 | 44,24 51.5,16.5 JP1.14 | MCU1.P$18 41.75,41.25 | 41.75,41.25 41.75,41.5 40,43.25 MCU1.P$12 v34,43.25 | MCU1.P$28 46.75,40 46.5,40.25 | 46.5,40.25 45.5,41.25 41.75,41.25 | MCU1.P$31 48.25,40 48,40.25 46.5,40.25 | BATTERY.P$1 29,26.25 38.75,16.5 JP1.4
  Bottom 0.305: FET4.P$1 58.25,14.75 60.5,14.75 60.5,14.5 63,12 C1.2 64.25,12 64.25,12.25 65,13 65,19.25 65.75,20 R2.2 66,20 66,36 | 66,36 63,36 63,38 GPS1.GND | 66,36 68.5,36 | 68.5,36 71,36 R4.1 | v54.75,47.25 57,47.25 C15.1 | 68.5,36 68.5,45.75 76,53.25 SWD.3 | 13,67 13,70 C17.2 | 13,63 13,59 | 13,63 13,67 | 13,67 C18.2 | 13,63 C11.2 | v20,25 FET1.P$1 | BATTERY.P$1 23,26.25 25,24.25 R1.1 | C9.1 29,80 S1.4 | DCDC1.P2 14,35 C3.2 | DCDC1.P2 18,35 C2.2 | 17.75,41.75 16,41.75 DCDC1.P2 | 17.75,41.75 19,41.75 C6.2 | 17.75,45.75 19,45.75 C5.2 | 17.75,41.75 17.75,45.75 | 16.75,47.25 17.75,47.25 17.75,45.75 | 16.75,47.25 14,47.25 IC1.4 14,50.25 12.5,51.75 | 16.75,47.25 16.75,50.75 19,50.75 C4.2 19,51 23.25,55.25 23.25,65 SEVOBAT.P$1 | 12.5,51.75 12.25,52 D3.A 12.5,51.75 | 13,59 12.5,58.5 12.5,51.75 | 13,59 C19.2 | C14.1 49.25,34 49.75,33.5 49.75,30.75 52,28.5 52,16.75 51.75,16.5 JP1.14 | 37.75,30.25 37.75,28.75 37,28 37,18.25 38.75,16.5 JP1.4 39,16.5 41.25,16.5 JP1.6 41.5,16.5 44,16.5 JP1.8 | 37.75,30.25 37.75,31.75 40,34 C13.1 | v47,69.5 47,71 C10.2 | C7.1 C8.1 28,46.25 32.25,46.25 34,48 | 34,53.75 34,58 BNO1.P2 | 34,53.75 34,48 | 34,48 v34,43.25 34,42.5 | 34,42.5 C12.1 | 34,53.75 40.75,53.75 41.25,54.25 41.25,54.5 41.75,55 C16.1 | 37.75,30.25 36.25,30.25 36.25,40.25 34,42.5
GPIO1  (via drill 0.3)
  Top 0.152: v40.5,41.75 MCU1.P$15
  Bottom 0.152: v40.5,41.75 44,38.25 44,17.75 45,16.75 45,15.25 46.5,13.75 JP1.9
GPIO2  (via drill 0.3)
  Top 0.152: MCU1.P$41 47.5,45.25 v46.25,44
  Bottom 0.152: v46.25,44 45.5,43.25 45.5,30.75 48,28.25 48,17.75 46.75,16.5 JP1.10
GPIO3  (via drill 0.3)
  Top 0.152: MCU1.P$26 45.75,33.25 v44.75,32.25
  Bottom 0.152: v44.75,32.25 44.5,32 44.5,17.75 45.5,16.75 45.5,15.75 46.5,14.75 49,14.75 49,13.75 JP1.11
GPIO4  (via drill 0.3)
  Top 0.152: v46.25,32.25 MCU1.P$27
  Bottom 0.152: v46.25,32.25 48.5,30 48.5,17 49,16.5 JP1.12
GPS_RX
  Top 0.152: MCU1.P$42 53.25,45.75 GPS1.RD0
GPS_TX  (via drill 0.3)
  Top 0.152: v53.75,46.25 MCU1.P$43
  Bottom 0.152: v53.75,46.25 59,41 59,38 GPS1.SD0
IM_BSY  (via drill 0.3)
  Top 0.152: v51.5,59 64.75,72.25 IM1.$P1 | v52,43.25 51.5,43.75 MCU1.P$38
  Bottom 0.152: v51.5,59 51.5,43.75 v52,43.25
IM_LED  (via drill 0.3)
  Top 0.152: v73,63 LED5.A
  Bottom 0.152: R11.2 v73,63
IM_R  (via drill 0.3)
  Top 0.152: v68,71.25 68,71.5 68.25,71.75 IM1.$P15
  Bottom 0.152: v68,71.25 68,60.25 73,60.25 R11.1
IM_RST  (via drill 0.3)
  Top 0.152: IM1.$P19 69.25,73 69,73.25 64.5,73.25 v50.75,59.5 | v49.5,43.75 50,43.25 MCU1.P$37
  Bottom 0.152: v50.75,59.5 50.75,50 51,49.75 51,45.25 v49.5,43.75
IM_RX  (via drill 0.3)
  Top 0.152: IM1.$P6 65.75,68 52,54.25 v48.5,54.25 | v38.75,40.5 39.25,41 MCU1.P$16
  Bottom 0.152: v48.5,54.25 43.5,54.25 40.5,51.25 38.75,51.25 v38.75,40.5
IM_TX  (via drill 0.3)
  Top 0.152: IM1.$P7 66.25,71.75 v49.5,55 | v36.5,41 37.25,41 39,39.25 MCU1.P$17
  Bottom 0.152: v49.5,55 43,55 43,54.25 40.5,51.75 36.25,51.75 36.25,41.25 v36.5,41
IMU_SCL
  Top 0.152: MCU1.P$58 44.25,54 40.25,58 40.25,58.25 39.5,59 37.75,59 36.75,58 BNO1.P3
  Bottom 0.152: R22.2 35.25,61 36.5,59.75 36.5,58 BNO1.P3
IMU_SDA
  Top 0.152: MCU1.P$59 43.75,53.5 39.25,58 BNO1.P4
  Bottom 0.152: R23.2 39.25,61 39.25,58 BNO1.P4
LED2  (via drill 0.3)
  Top 0.152: MCU1.P$2 v38,48.25
  Bottom 0.152: v38,48.25 38,40.25 43,35.25 43,33.25 42,32.25 42,27.25 43,26.25 R8.2
LED2R  (via drill 0.3)
  Top 0.152: v43,29 LED2.A
  Bottom 0.152: R8.1 v43,29
LED3  (via drill 0.3)
  Top 0.152: v45.25,27 41,27 v37,31 | v37.25,47.5 38.25,47.5 38.5,47.75 MCU1.P$3
  Bottom 0.152: v45.25,27 45.25,26.25 47,26.25 R9.2 | v37,31 37.25,31.25 v37.25,47.5
LED3R  (via drill 0.3)
  Top 0.152: v45.75,27.75 LED3.A
  Bottom 0.152: v45.75,27.75 LED3.A R9.1
LED4  (via drill 0.3)
  Top 0.152: v46.25,42.5 45.5,42.5 40.75,47.25 MCU1.P$4
  Bottom 0.152: v46.25,42.5 46.25,35 49,32.25 49,26.25 51,26.25 R10.2
LED4R  (via drill 0.3)
  Top 0.152: v49.75,27.75 LED4.A
  Bottom 0.152: v49.75,27.75 LED4.A R10.1
NRST
  Top 0.152: MCU1.P$7 33.75,45.75 33.25,45.25 30.75,45.25 19.5,56.5 19.5,66.5 19.25,66.75 19.25,77 25.75,83.5 27.75,83.5 28.75,82.5 28.75,79.75 S1.2
  Bottom 0.152: 30,74.25 26.75,77.5 S1.2 | 30,74.25 31,75.25 31,80 C9.2 | 30,74.25 R6.2
OSCIN
  Top 0.152: MCU1.P$5 30.5,46.75 30,47.25 Q1.1
  Bottom 0.152: Q1.1 30,47.75 28,47.75 C8.2
OSCOUT  (via drill 0.3)
  Top 0.152: MCU1.P$6 33.25,46.25 v33,46
  Bottom 0.152: v33,46 30,43 Q1.2 30,42.25 28,42.25 C7.2
PB_ARV2GATES  (via drill 0.3)
  Top 0.305: v56.75,13 52.5,13 52,12.5 v31.75,12.5
  Bottom 0.305: FET2.P$1 14,27 14,25 FET3.P$1 14,23 14,21.5 14.25,21.25 26,21.25 | FET5.P$1 FET4.P$2 56.75,13.75 v56.75,13 | D1.A R1.2 25,25.75 26,24.75 26,21.25 | v31.75,12.5 26,18.25 26,21.25
PB_FET2R
  Bottom 0.152: FET5.P$3 64,15 64,16 R3.1 64.25,16 64.25,20 R2.1
PBDET  (via drill 0.3)
  Top 0.152: MCU1.P$20 42.75,38.5 v44.75,36.5
  Bottom 0.152: R3.2 66,16 66,12 C1.1 65.75,12 65.75,11 57.75,11 56,12.75 56,33 48.25,40.75 48.25,44.75 46,44.75 45,43.75 45,36.75 v44.75,36.5
PBIN
  Bottom 0.305: FET4.P$3 52.75,15 52.75,14.75 51.75,13.75 JP1.13
PWR_SWC  (via drill 0.3)
  Top 0.305: v75,30.25 56.25,11.5 29.5,11.5 12.5,28.5 12.5,43 13.75,44.25 13.75,45 U$3.P$1
  Bottom 0.305: D2.C 77,32 FET7.P$2 v75,30.25
REG_DCDC2FET
  Bottom 0.305: FET6.P$2 75.75,37.25 75.75,36.25 78.25,33.75 78.25,22.25 63.75,7.75 20.75,7.75 20.75,14 13.5,21.25 13.5,31 | 13.5,31 13.5,33.5 12.25,34.75 12.25,35 | SJ1.2 16,28 16,28.5 13.5,31 | 12.25,35 12.25,36 13.25,37 DCDC1.P1 | 12.25,35 C3.1
REG_FET2FET
  Bottom 0.305: FET6.P$3 FET7.P$3
REG_R2LED  (via drill 0.3)
  Top 0.152: v37.75,27.75 LED1.A
  Bottom 0.152: v37.75,27.75 LED1.A R5.1
SDIOCLK  (via drill 0.3)
  Top 0.152: v46.5,59.25 45.75,58.5 45.75,54 46.75,53 MCU1.P$53
  Bottom 0.152: v46.5,59.25 46.5,64.5 47,65 R17.1
SDIOCLK_R  (via drill 0.3)
  Top 0.152: v46,73.25 46,71.75 CN1.CLK
  Bottom 0.152: v46,73.25 46,68 47,67 R17.2
SDIOCMD  (via drill 0.3)
  Top 0.152: v43,73.25 43.75,72.5 43.75,71.75 CN1.CMD | MCU1.P$54 46.25,53 45.25,54 v45.25,68.25
  Bottom 0.152: 44,74 43,74 v43,73.25 | v45.25,68.25 44,69.5 44,74 | 44,74 R14.2
SDIOD0  (via drill 0.3)
  Top 0.152: v48.25,70 48.25,71.5 CN1.DAT0 | MCU1.P$39 51.75,44.25 52,44 v52.75,44
  Bottom 0.152: v48.25,70 48.25,72.75 47,74 R15.2 47,75 50.75,75 53,72.75 53,44.25 v52.75,44
SDIOD1  (via drill 0.3)
  Top 0.152: v49,73.25 49,72 CN1.DAT1 | v52.25,44.75 MCU1.P$40
  Bottom 0.152: R16.2 50,74 49,74 v49,73.25 52.25,70 v52.25,44.75
SDIOD2  (via drill 0.3)
  Top 0.152: v39.75,74 41.5,72.25 41.5,71.75 CN1.DAT2 | MCU1.P$51 47.75,55.5 v48,55.75
  Bottom 0.152: R12.2 38,74 v39.75,74 39.75,67.75 43,64.5 43,55.75 v48,55.75
SDIOD3  (via drill 0.3)
  Top 0.152: v42,73.25 42.75,72.5 42.75,71.75 CN1.CD/DAT3 | v47.25,56.5 MCU1.P$52
  Bottom 0.152: R13.2 41,74 42,74 v42,73.25 43.5,71.75 43.5,63 45.25,61.25 45.25,56.5 v47.25,56.5
SERVO1  (via drill 0.3)
  Top 0.457: v18.75,58.5 18.75,39.75 40.25,18.25 40.25,15.75 41.25,14.75 41.25,13.75 JP1.5
  Bottom 0.457: 15,63 15,61 FET8.P$3 17.75,61 17.75,59.5 v18.75,58.5 | 15,63 15,67 C18.1 | 15,63 C11.1
SERVO2  (via drill 0.3)
  Top 0.457: JP1.7 44,14.5 42.75,15.75 42.75,16.75 19.5,40 v19.5,55.5
  Bottom 0.457: C17.1 15,70 15,69.5 17.5,67 FET9.P$3 17.25,67 17.25,63.25 18.5,62 18.5,60 19.5,59 19.5,56.75 | 19.5,56.75 17.25,56.75 15,59 C19.1 | 19.5,56.75 v19.5,55.5
SVGATE1  (via drill 0.3)
  Top 0.152: v43.25,40.5 MCU1.P$21 | v40.5,50 34.25,56.25 27,56.25 v21.25,62
  Bottom 0.152: R20.1 18.25,64 18.25,63.75 FET8.P$1 v21.25,62 | v43.25,40.5 41.75,42 41.75,48.75 v40.5,50
SVGATE2  (via drill 0.3)
  Top 0.152: MCU1.P$22 43.75,40 v44.25,40.5 | v39.5,50 32.25,50 20,62.25 v20,67
  Bottom 0.152: R21.1 18.25,71 18.25,69.75 FET9.P$1 v20,67 | v44.25,40.5 42.25,42.5 42.25,49.25 40.75,50.75 39.5,50.75 v39.5,50
SVIN
  Bottom 0.457: 20,64 20,65.75 | 20,65.75 20.75,66.5 20.75,67 21,67.25 21,70 20,71 R21.2 | 20,65.75 FET9.P$2 | FET8.P$2 22,60 SEVOBAT.P$2 22,64 20,64 | 20,64 R20.2
SWCLK  (via drill 0.3)
  Top 0.152: MCU1.P$49 50.5,50.75 56,56.25 v73.5,56.25
  Bottom 0.152: v73.5,56.25 76,58.75 SWD.1
SWDIO  (via drill 0.3)
  Top 0.152: MCU1.P$46 49.75,47.75 v49.5,47.5 | v56.25,55.5 v50.25,49.5
  Bottom 0.152: v49.5,47.5 50.25,48.25 v50.25,49.5 | v56.25,55.5 76,55.5 76,56 SWD.2
USBDM  (via drill 0.3)
  Top 0.152: v49,46.75 MCU1.P$44 | v58.25,33 59.25,32 67.75,32 79.75,44 80.75,44 X1.2
  Bottom 0.152: v49,46.75 48.75,46.5 48.75,42.5 v58.25,33
USBDP  (via drill 0.3)
  Top 0.152: X1.3 v79,45 | v53.75,47.25 MCU1.P$45
  Bottom 0.152: R18.2 75,45 v79,45 79,59.75 75,59.75 74.5,59.25 59,59.25 54,54.25 54,47.5 v53.75,47.25
USBIN  (via drill 0.3)
  Top 0.305: v76,39 80.25,43.25 80.75,43.25 X1.1
  Bottom 0.305: 72,33 71,34 R4.2 | 72,33 FET7.P$1 | 72,33 72,37 FET6.P$1 73,39 75.5,39 75.75,38.75 | 75.75,38.75 75.75,38.25 77,37 D2.A | 75.75,38.75 v76,39

### Text on the board
tDocu: 0 | 1 | SWCLK | SWDIO | GND | ON | OFF | SDA | GND | GND | GND | GPIO2 | GPIO4 | GND | SCL | 3.3V | 5V1 | 5V2 | GPIO1 | GPIO3 | Pb+